# EAGLE design MIDI Merge Module v0.2 (EAGLE 7.7.0)
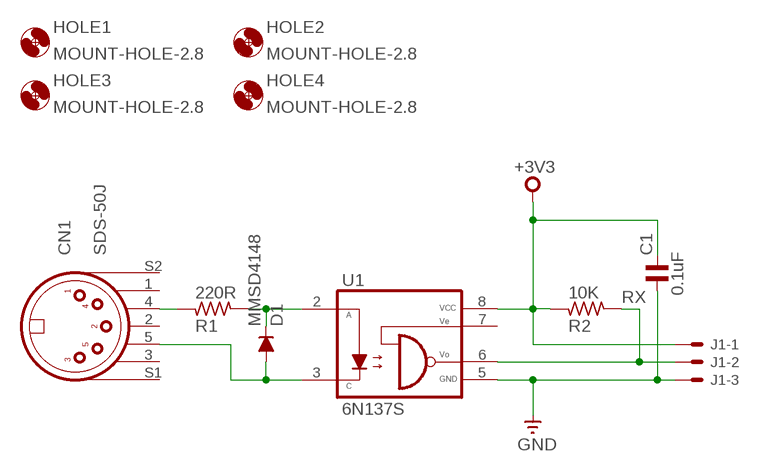
[diagram p0: schematic, sheet 1]

## Parts
C1  0.1uF  C_1206MP  [C1206MP]
CN1  SDS-50J  [SDS-50J]
D1  MMSD4148  [SOD123]
HOLE1  MOUNT-HOLE-2.8  [2,8]
HOLE2  MOUNT-HOLE-2.8  [2,8]
HOLE3  MOUNT-HOLE-2.8  [2,8]
HOLE4  MOUNT-HOLE-2.8  [2,8]
J1  22-05-7038-03  [7395-03]
R1  220R  R_0805MP  [R0805MP]
R2  10K  R_0805MP  [R0805MP]
U1  6N137S  [SMD8]

## Nets
+3V3: C1.2 J1.1 R2.1 U1.8(VCC)
GND: C1.1 J1.3 U1.5(GND)
N$1: CN1.4 R1.1
N$2: D1.C R1.2 U1.2(A)
N$3: CN1.5 D1.A U1.3(C)
RX: J1.2 R2.2 U1.6(VO)
Unconnected: CN1.1 CN1.2 CN1.3 CN1.S1 CN1.S2 U1.7(VE)

## Library data of the parts
C1 = rc-master:C_: NON-POLARIZED CAP
CN1 = jdc:SDS-50J: DIN 5-Pin - Circular
D1 = diode:MMSD4148: DIODE ON Semiconductor, 100V, 1Vf, SOD-123
HOLE1-HOLE4 = holes:MOUNT-HOLE-: MOUNTING HOLE with drill center marker; BOM: EXCLUDE
J1 = con-molex:22-?-03: CONNECTOR wire to board 2.54 mm (.1 inch) pitch header
R1 R2 = rc-master:R_: RESISTOR
U1 = optocoupler:6N137: MOTOROLA OPTO COUPLER

## Board
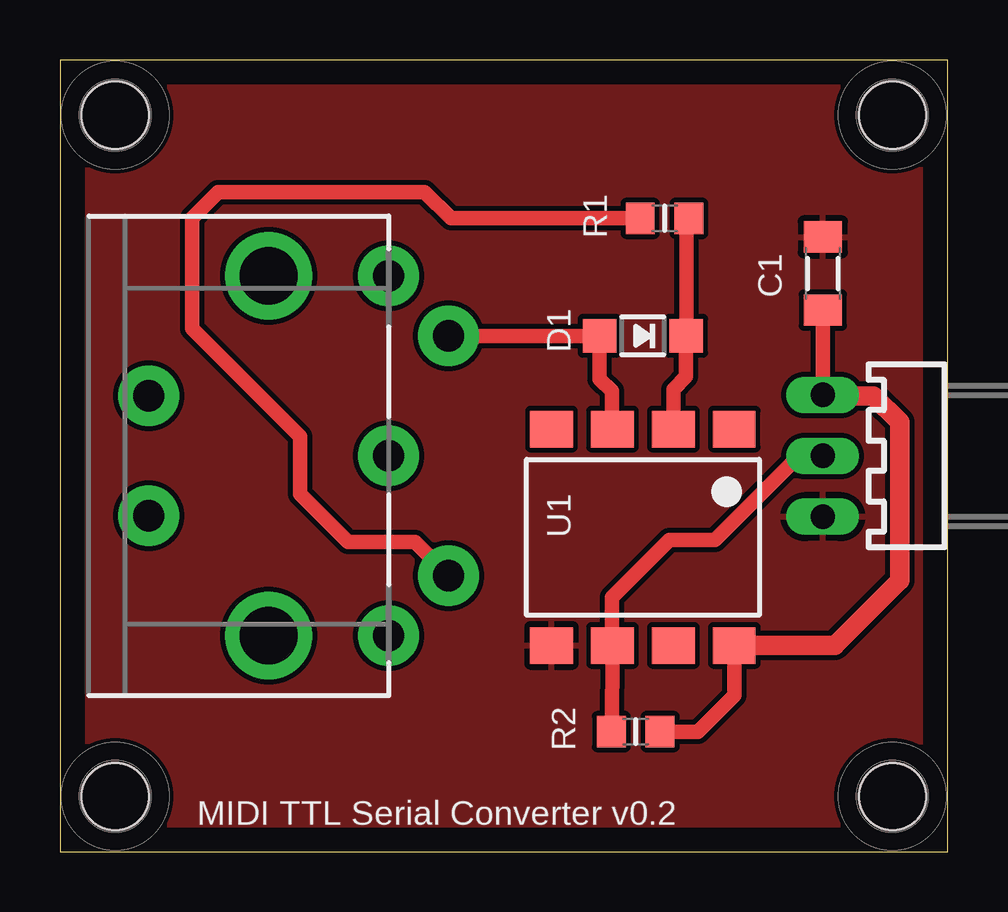
[diagram p1: board, top side]
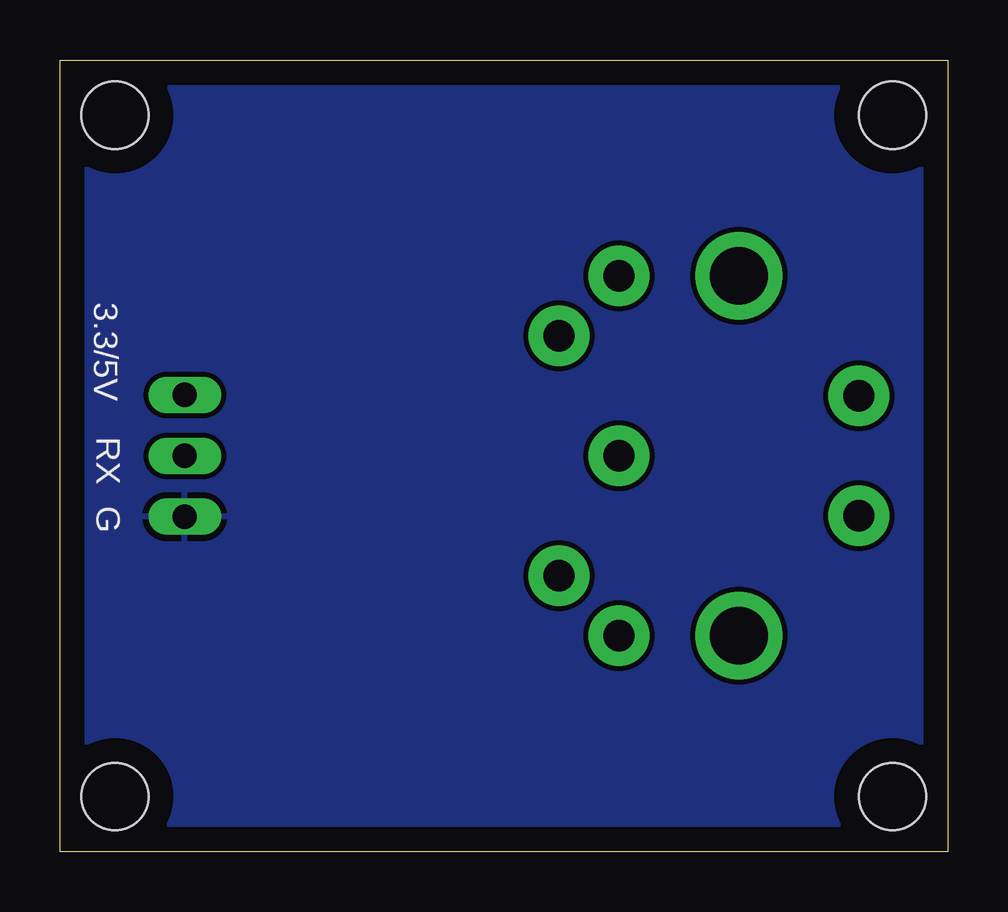
[diagram p2: board, bottom side, seen from below]

Size 37 x 33 mm. Coordinates in mm from the lower left corner, seen from the top.
Outline: 0,0 37,0 37,33 0,33 0,0
Copper layers (1*16): Top 0.035mm / dielectric 1.5mm / Bottom 0.035mm
Design rules "default": minimum track width 10mil, minimum drill 0.6mm, track to track 8mil, track to pad 8mil, pad to pad 8mil, via to via 8mil, smd to smd 8mil, copper to edge 40mil, drill to drill 8mil, minimum pad ring 10mil, minimum via ring 8mil, stop-mask expansion 4mil, vias tented up to drill 0mil, thermal gap 10mil

### Footprints (pad centres in the part's own frame; a part is rotated, then mirrored left to right if it is on the bottom)
C1206MP = smd 1.3 x 1.6: 1 -1.524,0; 2 1.524,0
SDS-50J = drill 1.3 pad 2.54: 1 7.5,5; 2 0,5; 3 -7.5,5; 4 5,7.5; 5 -5,7.5; S1 -2.5,-5; S2 2.5,-5 | drill 2.4 pad 3.64: S3 -7.5,0; S4 7.5,0
SOD123 = smd 1.4 x 1.4: A 1.805,0; C -1.805,0
2,8 = hole 2.8: 0,0
7395-03 = drill 1.016 long: 1 2.54,0; 2 0,0; 3 -2.54,0
R0805MP = smd 1.2 x 1.3: 1 -1.016,0; 2 1.016,0
SMD8 = smd 1.778 x 1.524: 1 -3.81,-4.508; 2 -1.27,-4.508; 3 1.27,-4.508; 4 3.81,-4.508; 5 3.81,4.508; 6 1.27,4.508; 7 -1.27,4.508; 8 -3.81,4.508

### Placement (x,y rotation side)
C1  31.8,24.1 270 top
CN1  8.7,16.5 270 top
D1  24.3,21.5 180 top
HOLE1  2.3,2.3 0 top
HOLE2  2.3,30.7 0 top
HOLE3  34.7,2.3 0 top
HOLE4  34.7,30.7 0 top
J1  31.8,16.5 90 top
R1  25.2,26.4 0 top
R2  24,5 180 top
U1  24.3,13.1 180 top

### Tracks (layer width: path | path; a pad name or v marks a point on that pad's centre or on a via)
+3V3
  Top 0.61: U1.8 28.11,6.51 26.6,5 R2.1 | J1.1 C1.2
  Top 0.813: U1.8 32.3,8.6 35,11.3 35,17.9 33.9,19 31.84,19 J1.1
GND
  pour Top: -1,-1 38,-1 38,34 -1,34
  pour Bottom: -1.9,-2 39,-2 39,35 -2,35 -2,-2
N$1
  Top 0.61: CN1.4 14.8,12.9 12,12.9 10,14.9 10,17.3 5.5,21.8 5.5,26.4 6.6,27.5 15.2,27.5 16.3,26.4 R1.1
N$2
  Top 0.61: U1.2 25.57,19.27 26.1,19.8 D1.C 26.11,26.35 R1.2
N$3
  Top 0.61: U1.3 23,17.64 23,19.2 22.5,19.7 D1.A CN1.5
RX
  Top 0.61: R2.2 23.05,8.57 U1.6 23,8.62 23,10.6 25.4,13 27.3,13 30.8,16.5 J1.2

### Text on the board
tNames: MIDI TTL Serial Converter v0.2
bNames: 3.3/5V | RX | G